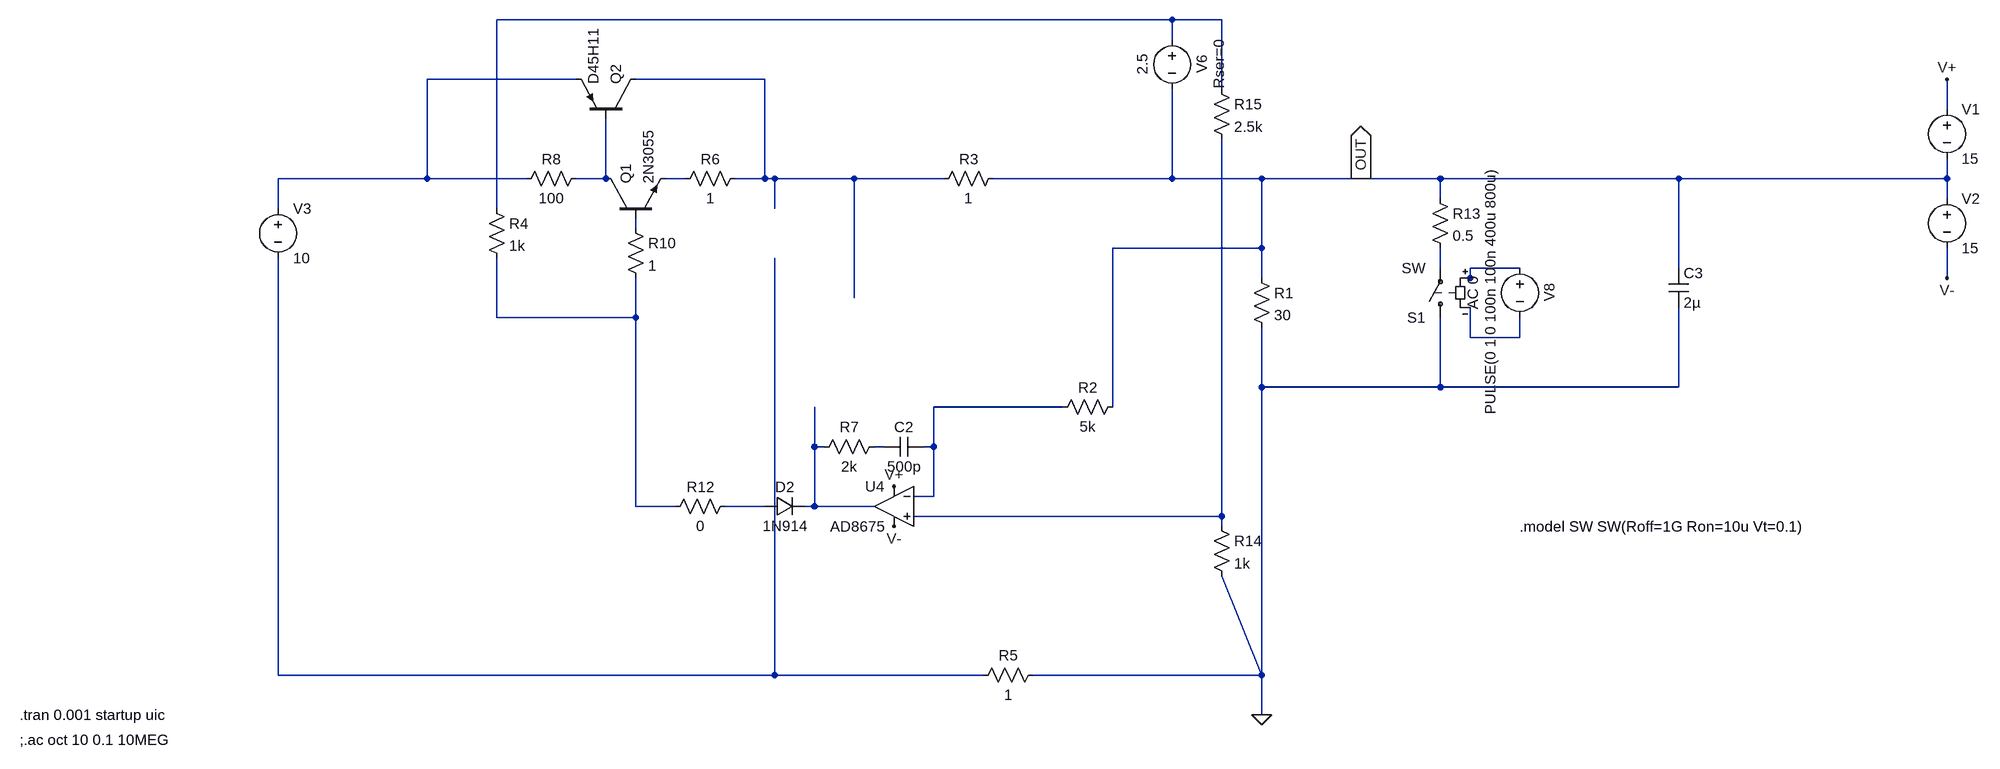
[diagram p0: schematic blackdog_experiments_investigate_voltage_variation_with_load.asc]
blackdog_experiments_investigate_voltage_variation_with_load.asc, the LTspice schematic file:
Version 4
SHEET 1 2424 1220
WIRE 1120 -384 32 -384
WIRE 1200 -384 1120 -384
WIRE 1120 -352 1120 -384
WIRE 160 -288 -80 -288
WIRE 464 -288 256 -288
WIRE 1200 -272 1200 -384
WIRE 2368 -240 2368 -288
WIRE -80 -128 -80 -288
WIRE -80 -128 -320 -128
WIRE 80 -128 -80 -128
WIRE 208 -128 208 -224
WIRE 208 -128 160 -128
WIRE 336 -128 304 -128
WIRE 464 -128 464 -288
WIRE 464 -128 416 -128
WIRE 480 -128 464 -128
WIRE 608 -128 480 -128
WIRE 752 -128 608 -128
WIRE 1120 -128 1120 -272
WIRE 1120 -128 832 -128
WIRE 1264 -128 1120 -128
WIRE 1424 -128 1264 -128
WIRE 1552 -128 1424 -128
WIRE 1936 -128 1552 -128
WIRE 2368 -128 2368 -160
WIRE 2368 -128 1936 -128
WIRE 1552 -96 1552 -128
WIRE 2368 -96 2368 -128
WIRE -320 -80 -320 -128
WIRE 32 -80 32 -384
WIRE 480 -80 480 -128
WIRE 256 -48 256 -64
WIRE 1264 -16 1264 -128
WIRE 1264 -16 1024 -16
WIRE 1552 16 1552 -16
WIRE 1680 16 1600 16
WIRE 1936 16 1936 -128
WIRE 1264 32 1264 -16
WIRE 1600 32 1600 16
WIRE 1600 32 1584 32
WIRE 2368 32 2368 -16
WIRE 608 64 608 -128
WIRE 32 96 32 0
WIRE 256 96 256 32
WIRE 256 96 32 96
WIRE 1600 128 1600 80
WIRE 1680 128 1680 96
WIRE 1680 128 1600 128
WIRE 1264 208 1264 112
WIRE 1552 208 1552 96
WIRE 1552 208 1264 208
WIRE 1936 208 1936 80
WIRE 1936 208 1552 208
WIRE 944 240 736 240
WIRE 1024 240 1024 -16
WIRE 544 304 544 240
WIRE 560 304 544 304
WIRE 656 304 640 304
WIRE 736 304 736 240
WIRE 736 304 720 304
WIRE 736 384 736 304
WIRE 736 384 704 384
WIRE 256 400 256 96
WIRE 320 400 256 400
WIRE 464 400 400 400
WIRE 544 400 544 304
WIRE 544 400 528 400
WIRE 640 400 544 400
WIRE 1200 416 1200 -192
WIRE 1200 416 704 416
WIRE 1200 432 1200 416
WIRE -320 672 -320 0
WIRE 480 672 480 0
WIRE 480 672 -320 672
WIRE 816 672 480 672
WIRE 1264 672 1264 208
WIRE 1264 672 1200 512
WIRE 1264 672 896 672
WIRE 1264 736 1264 672
FLAG 2368 -288 V+
FLAG 2368 32 V-
FLAG 672 368 V+
FLAG 672 432 V-
FLAG 1264 736 0
FLAG 1424 -128 OUT
IOPIN 1424 -128 Out
SYMBOL voltage 2368 -256 R0
WINDOW 123 0 0 Left 0
WINDOW 39 0 0 Left 0
SYMATTR InstName V1
SYMATTR Value 15
SYMBOL voltage 2368 -112 R0
WINDOW 123 0 0 Left 0
WINDOW 39 0 0 Left 0
SYMATTR InstName V2
SYMATTR Value 15
SYMBOL npn 208 -64 R270
SYMATTR InstName Q1
SYMATTR Value 2N3055
SYMBOL voltage -320 -96 R0
WINDOW 123 0 0 Left 0
WINDOW 39 0 0 Left 0
SYMATTR InstName V3
SYMATTR Value 10
SYMBOL diode 464 416 R270
WINDOW 0 32 32 VTop 2
WINDOW 3 0 32 VBottom 2
SYMATTR InstName D2
SYMATTR Value 1N914
SYMBOL res 1248 16 R0
SYMATTR InstName R1
SYMATTR Value 30
SYMBOL res 1040 224 R90
WINDOW 0 0 56 VBottom 2
WINDOW 3 32 56 VTop 2
SYMATTR InstName R2
SYMATTR Value 5k
SYMBOL res 736 -112 R270
WINDOW 0 32 56 VTop 2
WINDOW 3 0 56 VBottom 2
SYMATTR InstName R3
SYMATTR Value 1
SYMBOL res 912 656 R90
WINDOW 0 0 56 VBottom 2
WINDOW 3 32 56 VTop 2
SYMATTR InstName R5
SYMATTR Value 1
SYMBOL res 240 -64 R0
SYMATTR InstName R10
SYMATTR Value 1
SYMBOL res 416 384 R90
WINDOW 0 0 56 VBottom 2
WINDOW 3 32 56 VTop 2
SYMATTR InstName R12
SYMATTR Value 0
SYMBOL cap 1920 16 R0
SYMATTR InstName C3
SYMATTR Value 2µ
SYMATTR SpiceLine Rser=0.1
SYMBOL Opamps\\AD8675 672 336 M0
SYMATTR InstName U4
SYMBOL res 656 288 R90
WINDOW 0 0 56 VBottom 2
WINDOW 3 32 56 VTop 2
SYMATTR InstName R7
SYMATTR Value 2k
SYMBOL cap 720 288 R90
WINDOW 0 0 32 VBottom 2
WINDOW 3 32 32 VTop 2
SYMATTR InstName C2
SYMATTR Value 500p
SYMBOL voltage 1120 -368 R0
WINDOW 0 32 56 VTop 2
WINDOW 3 -32 56 VBottom 2
WINDOW 123 -60 56 VBottom 2
WINDOW 39 60 56 VTop 2
SYMATTR InstName V6
SYMATTR Value 2.5
SYMATTR SpiceLine Rser=0
SYMBOL sw 1552 112 R180
SYMATTR InstName S1
SYMBOL voltage 1680 0 R0
WINDOW 0 32 56 VTop 2
WINDOW 3 -32 56 VBottom 2
WINDOW 123 -60 56 VBottom 2
WINDOW 39 0 0 Left 0
SYMATTR InstName V8
SYMATTR Value PULSE(0 1 0 100n 100n 400u 800u)
SYMATTR Value2 AC 0
SYMBOL res 1536 -112 R0
SYMATTR InstName R13
SYMATTR Value 0.5
SYMBOL res 1184 416 R0
SYMATTR InstName R14
SYMATTR Value 1k
SYMBOL res 1184 -288 R0
SYMATTR InstName R15
SYMATTR Value 2.5k
SYMBOL res 16 -96 R0
SYMATTR InstName R4
SYMATTR Value 1k
SYMBOL pnp 256 -224 M270
SYMATTR InstName Q2
SYMATTR Value D45H11
SYMBOL res 432 -144 R90
WINDOW 0 0 56 VBottom 2
WINDOW 3 32 56 VTop 2
SYMATTR InstName R6
SYMATTR Value 1
SYMBOL res 176 -144 R90
WINDOW 0 0 56 VBottom 2
WINDOW 3 32 56 VTop 2
SYMATTR InstName R8
SYMATTR Value 100
TEXT -736 736 Left 2 !.tran 0.001 startup uic
TEXT -736 776 Left 2 !;.ac oct 10 0.1 10MEG
TEXT 1680 432 Left 2 !.model SW SW(Roff=1G Ron=10u Vt=0.1)

The netlist it stands for:
* blackdog_experiments_investigate_voltage_variation_with_load.asc
V1 V+ OUT 15
V2 OUT V- 15
Q1 N004 N006 N005 0 2N3055
V3 N002 N016 10
D2 N014 N012 1N914
R1 OUT 0 30
R2 OUT N011 5k
R3 N003 OUT 1
R5 0 N016 1
R10 N006 N009 1
R12 N014 N009 0
C3 OUT 0 2µ Rser=0.1
XU4 N015 N011 V+ V- N012 AD8675  ; pins In+ In- V+ V- OUT
R7 N013 N012 2k
C2 N011 N013 500p
V6 N001 OUT 2.5 Rser=0
S1 0 N007 N008 N010 SW
V8 N008 N010 PULSE(0 1 0 100n 100n 400u 800u) AC 0
R13 OUT N007 0.5
R14 N015 0 1k
R15 N001 N015 2.5k
R4 N001 N009 1k
Q2 N003 N004 N002 0 D45H11
R6 N003 N005 1
R8 N004 N002 100
.model D D
.lib standard.dio
.model NPN NPN
.model PNP PNP
.lib standard.bjt
.tran 0.001 startup uic
;.ac oct 10 0.1 10MEG
.model SW SW(Roff=1G Ron=10u Vt=0.1)
.backanno
.end